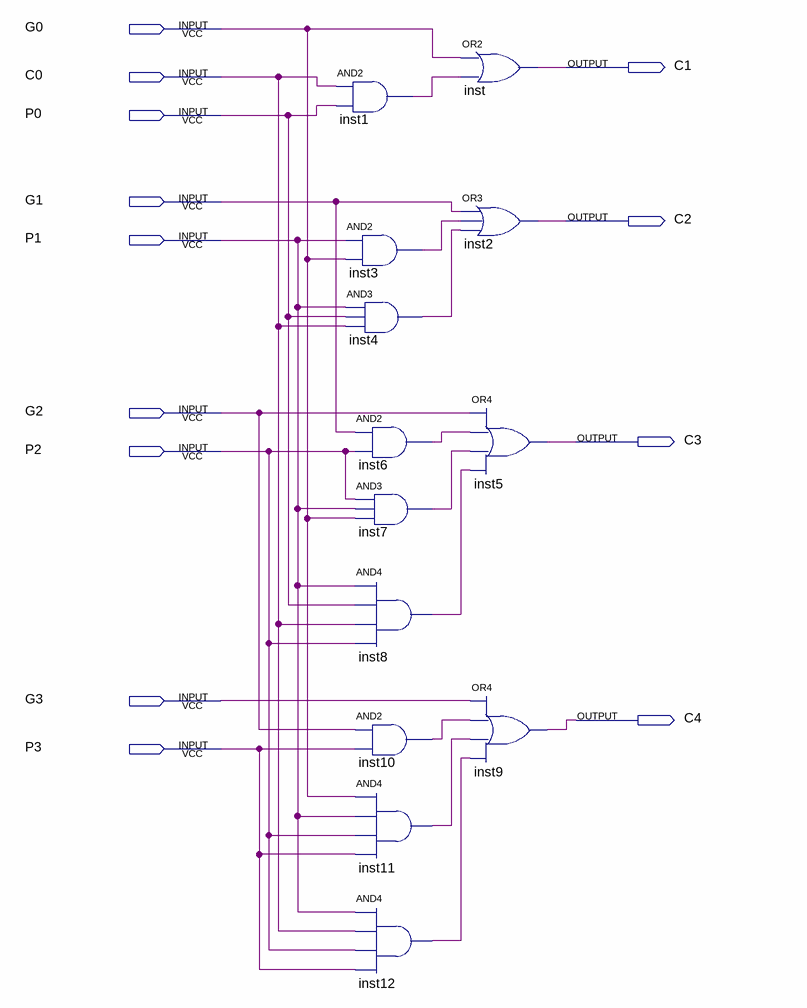
[diagram p0: schematic sheet]
// Quartus schematic CLA_logic.bdf as structural Verilog: 13 symbols, 13 pins
module CLA_logic (
  input  G0,
  input  C0,
  input  P0,
  input  G1,
  input  P1,
  input  G2,
  input  P2,
  input  G3,
  input  P3,
  output C1,
  output C2,
  output C3,
  output C4
);

  wire inst1_out, inst3_out, inst4_out, inst6_out, inst7_out, inst8_out, inst10_out, inst11_out, inst12_out;

  and inst1 (inst1_out, C0, P0);
  and inst3 (inst3_out, P1, G0);
  and inst4 (inst4_out, P1, P0, C0);
  and inst6 (inst6_out, G1, P2);
  and inst7 (inst7_out, P2, P1, G0);
  and inst8 (inst8_out, P1, P0, C0, P2);
  and inst10 (inst10_out, G2, P3);
  and inst11 (inst11_out, G0, P1, P2, P3);
  and inst12 (inst12_out, P1, C0, P2, P3);
  or inst (C1, G0, inst1_out);
  or inst2 (C2, G1, inst3_out, inst4_out);
  or inst5 (C3, G2, inst6_out, inst7_out, inst8_out);
  or inst9 (C4, G3, inst10_out, inst11_out, inst12_out);
endmodule
